# Altium schematic sheet MCU.SchDoc: Title
size A4; Date: *******; ApprovedBy: *******; CheckedBy: Yasiru; Author: *******; CompanyName: *******; DrawnBy: Name; Engineer: *******; Organization: *******; Address1: *******; Address2: *******; Address3: *******; Address4: *******; DocumentNumber: Doc Num; Revision: *******; SheetNumber: 9; SheetTotal: 11; Subtitle: MCU; Project: Resturant Robot; VersionRevision: III; TotalSheet: 11; CurrentTime: *******; CurrentDate: *******; Time: *******; DocumentFullPathAndName: *******; DocumentName: *******; ModifiedDate: *******; ImagePath: *******; ProjectName: *******; Application_BuildNumber: *******
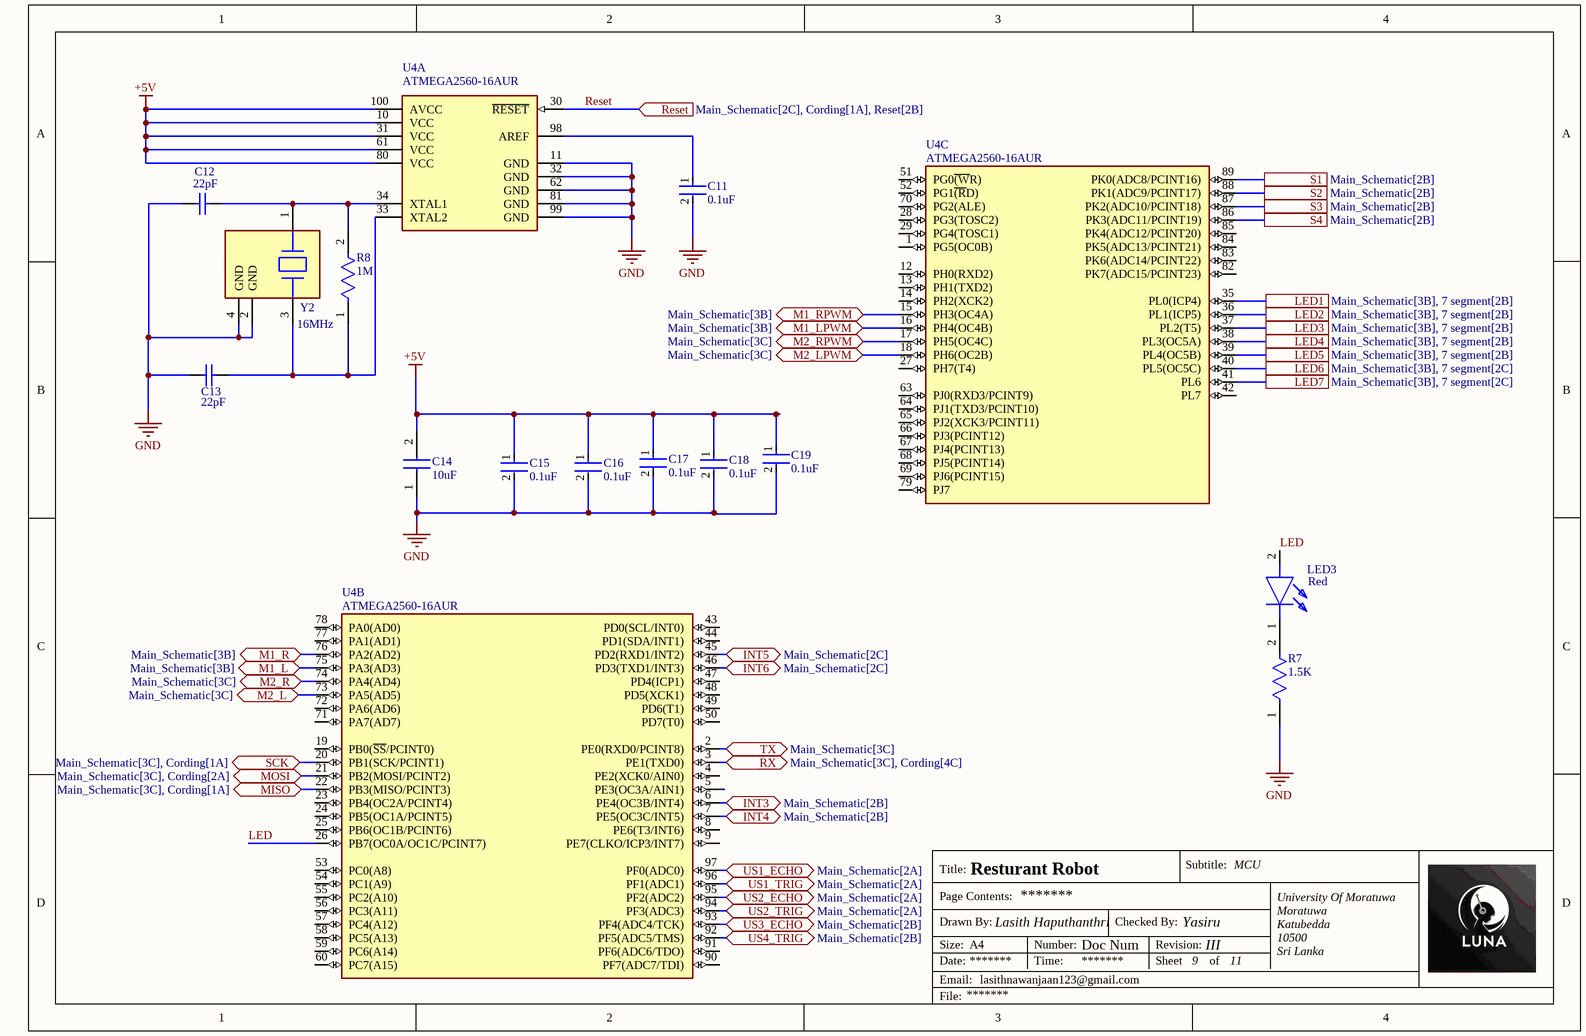
[diagram p0: MCU.SchDoc]

## Parts
C11  0.1uF  [FP-CC0603-DA-MFG]
C12  22pF  [CAPC1608X90X40LL10T20]
C13  22pF  [CAPC1608X90X40LL10T20]
C14  10uF  [CAPC1608X90N]
C15  0.1uF  [FP-CC0603-DA-MFG]
C16  0.1uF  [FP-CC0603-DA-MFG]
C17  0.1uF  [FP-CC0603-DA-MFG]
C18  0.1uF  [FP-CC0603-DA-MFG]
C19  0.1uF  [FP-CC0603-DA-MFG]
LED3  Red  [LEDC1608X55N]
R7  1.5K  [FP-AF0603-IPC_B]
R8  1M  [FP-AF0603-IPC_B]
U4  ATMEGA2560-16AUR  [FP-100A-MFG]  (parts A,B,C of 3)
Y2  16MHz  [FP-ABM8G-MFG]

## Ports
INT3 (bidir, see Main_Schematic[2B]), INT4 (bidir, see Main_Schematic[2B]), INT5 (bidir, see Main_Schematic[2C]), INT6 (bidir, see Main_Schematic[2C]), LED1 (see Main_Schematic[3B], 7 segment[2B]), LED2 (see Main_Schematic[3B], 7 segment[2B]), LED3 (see Main_Schematic[3B], 7 segment[2B]), LED4 (see Main_Schematic[3B], 7 segment[2B]), LED5 (see Main_Schematic[3B], 7 segment[2B]), LED6 (see Main_Schematic[3B], 7 segment[2C]), LED7 (see Main_Schematic[3B], 7 segment[2C]), M1_L (bidir, see Main_Schematic[3B]), M1_LPWM (bidir, see Main_Schematic[3B]), M1_R (bidir, see Main_Schematic[3B]), M1_RPWM (bidir, see Main_Schematic[3B]), M2_L (bidir, see Main_Schematic[3C]), M2_LPWM (bidir, see Main_Schematic[3C]), M2_R (bidir, see Main_Schematic[3C]), M2_RPWM (bidir, see Main_Schematic[3C]), MISO (bidir, see Main_Schematic[3C], Cording[1A]), MOSI (bidir, see Main_Schematic[3C], Cording[2A]), Reset (in, see Main_Schematic[2C], Cording[1A], Reset[2B]), RX (bidir, see Main_Schematic[3C], Cording[4C]), S1 (see Main_Schematic[2B]), S2 (see Main_Schematic[2B]), S3 (see Main_Schematic[2B]), S4 (see Main_Schematic[2B]), SCK (bidir, see Main_Schematic[3C], Cording[1A]), TX (bidir, see Main_Schematic[3C]), US1_ECHO (bidir, see Main_Schematic[2A]), US1_TRIG (bidir, see Main_Schematic[2A]), US2_ECHO (bidir, see Main_Schematic[2A]), US2_TRIG (bidir, see Main_Schematic[2A]), US3_ECHO (bidir, see Main_Schematic[2B]), US4_TRIG (bidir, see Main_Schematic[2B])

## Nets
+5V: C14.2 C15.1 C16.1 C17.1 C18.1 C19.1 U4.10(VCC) U4.31(VCC) U4.61(VCC) U4.80(VCC) U4.100(AVCC)
GND: C11.2 C12.1 C13.1 C14.1 C15.2 C16.2 C17.2 C18.2 C19.2 R7.1 U4.11(GND) U4.32(GND) U4.62(GND) U4.81(GND) U4.99(GND) Y2.2(GND) Y2.4(GND)
INT3: U4.6(PE4(OC3B/INT4)) ; port INT3
INT4: U4.7(PE5(OC3C/INT5)) ; port INT4
INT5: U4.45(PD2(RXD1/INT2)) ; port INT5
INT6: U4.46(PD3(TXD1/INT3)) ; port INT6
LED: LED3.2(A) U4.26(PB7(OC0A/OC1C/PCINT7))
LED1: U4.35(PL0(ICP4)) ; port LED1
LED2: U4.36(PL1(ICP5)) ; port LED2
LED3: U4.37(PL2(T5)) ; port LED3
LED4: U4.38(PL3(OC5A)) ; port LED4
LED5: U4.39(PL4(OC5B)) ; port LED5
LED6: U4.40(PL5(OC5C)) ; port LED6
LED7: U4.41(PL6) ; port LED7
M1_L: U4.75(PA3(AD3)) ; port M1_L
M1_LPWM: U4.16(PH4(OC4B)) ; port M1_LPWM
M1_R: U4.76(PA2(AD2)) ; port M1_R
M1_RPWM: U4.15(PH3(OC4A)) ; port M1_RPWM
M2_L: U4.73(PA5(AD5)) ; port M2_L
M2_LPWM: U4.18(PH6(OC2B)) ; port M2_LPWM
M2_R: U4.74(PA4(AD4)) ; port M2_R
M2_RPWM: U4.17(PH5(OC4C)) ; port M2_RPWM
MISO: U4.22(PB3(MISO/PCINT3)) ; port MISO
MOSI: U4.21(PB2(MOSI/PCINT2)) ; port MOSI
Reset: U4.30(~{RESET}) ; port Reset
RX: U4.3(PE1(TXD0)) ; port RX
S1: U4.89(PK0(ADC8/PCINT16)) ; port S1
S2: U4.88(PK1(ADC9/PCINT17)) ; port S2
S3: U4.87(PK2(ADC10/PCINT18)) ; port S3
S4: U4.86(PK3(ADC11/PCINT19)) ; port S4
SCK: U4.20(PB1(SCK/PCINT1)) ; port SCK
TX: U4.2(PE0(RXD0/PCINT8)) ; port TX
US1_ECHO: U4.97(PF0(ADC0)) ; port US1_ECHO
US1_TRIG: U4.96(PF1(ADC1)) ; port US1_TRIG
US2_ECHO: U4.95(PF2(ADC2)) ; port US2_ECHO
US2_TRIG: U4.94(PF3(ADC3)) ; port US2_TRIG
US3_ECHO: U4.93(PF4(ADC4/TCK)) ; port US3_ECHO
US4_TRIG: U4.92(PF5(ADC5/TMS)) ; port US4_TRIG
NetC11_1: C11.1 U4.98(AREF)
NetC12_2: C12.2 R8.2 U4.34(XTAL1) Y2.1
NetC13_2: C13.2 R8.1 U4.33(XTAL2) Y2.3
NetLED3_1: LED3.1(K) R7.2

Not connected (* = marked no-connect by the designer): U4 1(PG5(OC0B)) 4(PE2(XCK0/AIN0)) 5(PE3(OC3A/AIN1)) 8(PE6(T3/INT6)) 9(PE7(CLKO/ICP3/INT7)) 12(PH0(RXD2)) 13(PH1(TXD2)) 14(PH2(XCK2)) 19(PB0(~{SS}/PCINT0)) 23(PB4(OC2A/PCINT4)) 24(PB5(OC1A/PCINT5)) 25(PB6(OC1B/PCINT6)) 27(PH7(T4)) 28(PG3(TOSC2)) 29(PG4(TOSC1)) 42(PL7) 43(PD0(SCL/INT0)) 44(PD1(SDA/INT1)) 47(PD4(ICP1)) 48(PD5(XCK1)) 49(PD6(T1)) 50(PD7(T0)) 51(PG0~{(W}R)) 52(PG1~{(R}D)) 53(PC0(A8)) 54(PC1(A9)) 55(PC2(A10)) 56(PC3(A11)) 57(PC4(A12)) 58(PC5(A13)) 59(PC6(A14)) 60(PC7(A15)) 63(PJ0(RXD3/PCINT9)) 64(PJ1(TXD3/PCINT10)) 65(PJ2(XCK3/PCINT11)) 66(PJ3(PCINT12)) 67(PJ4(PCINT13)) 68(PJ5(PCINT14)) 69(PJ6(PCINT15)) 70(PG2(ALE)) 71(PA7(AD7)) 72(PA6(AD6)) 77(PA1(AD1)) 78(PA0(AD0)) 79(PJ7) 82(PK7(ADC15/PCINT23)) 83(PK6(ADC14/PCINT22)) 84(PK5(ADC13/PCINT21)) 85(PK4(ADC12/PCINT20)) 90(PF7(ADC7/TDI)) 91(PF6(ADC6/TDO))

## Notes on the sheet
- Title:
- Drawn By:
- Page Contents:
- Checked By:
- Subtitle:
- University Of Moratuwa
- Moratuwa
- Size:
- Date:
- File:
- Email:
- A4
- lasithnawanjaan123@gmail.com
- Lasith Haputhanthri
- Number:
- Time:
- Revision:
- Sheet
- of
- Katubedda
- 10500
- Sri Lanka

## Library data of the parts
C11 C15-C19 = CMP-2100-03601-2: CC0603KRX7R9BB104 CAP CER 0.1UF 50V X7R 0603; Manufacturer: YAGEO; Material: Ceramic; Capacitance: 100 nF; Temperature Coefficient: 15%; Tolerance: 0.1; Value: 100 nF; Height: 0.9mm; Voltage: 50 V; ComponentLink2Description: Datasheet; Device Class L2: Capacitors; Temperature Range High: +125°C; Category: Cap; Footprint Url: http://www.yageo.com/exep/pages/download/literatures/UPY-C_GEN_24.pdf; ComponentLink2URL: http://www.yageo.com/documents/recent/UPY-GPHC_X7R_6.3V-to-50V_18.pdf; Package: CC0603-DA; Temperature: -55°C to +125°C; Voltage Rating: 50 V; Temperature Characteristic: X7R; Device Class L1: Passive Components; Temperature Range Low: -55°C; Manufacturer Part Number: CC0603KRX7R9BB104; RoHS: TRUE; Automotive: No; Device Class L3: Ceramic Capacitors; Octopart: https://octopart.com/cc0603krx7r9bb104-yageo-42244635; Mouser Description: Multilayer Ceramic Capacitor, CC Series, 0.1 - F, - 10%, X7R, 50 V, 0603 [1608 Metric]; Lead Free: Yes; Digikey Description: CAP CER 0.1UF 50V X7R 0603
C12 C13 = CMP-1659-00026-1: CC0603JRNPO9BN220 Chip Capacitor, 22 pF, +/- 5%, 50 V, -55 to 125 degC, 0603 (1608 Metric), RoHS, Tape and Reel; ComponentLink1URL: http://www.yageo.com/; PackageReference: 0603; ComponentLink1Description: Manufacturer URL; PackageDescription: 2-Pin Surface Mount Device, Body 1.6 x 0.8 mm; DatasheetVersion: Rev. 8, 08/2011; ComponentLink2Description: Datasheet; ComponentLink2URL: http://www.yageo.com/documents/recent/UPY-GP_NP0_16V-to-50V_8.pdf
C14 = CL10A106KP8NNNC: CL10A106KP8NNNC Capacitor; Manufacturer_Name: SAMSUNG; Datasheet Link: https://datasheet.datasheetarchive.com/originals/distributors/Datasheets-DGA10/2415998.pdf; Height: 0.9mm; Manufacturer_Part_Number: CL10A106KP8NNNC; Mouser Part Number: 187-CL10A106KP8NNNC; Mouser Price/Stock: https://www.mouser.co.uk/ProductDetail/Samsung-Electro-Mechanics/CL10A106KP8NNNC?qs=X6jEic%2FHinAlyfRHj7fKwg%3D%3D; Arrow Part Number: CL10A106KP8NNNC; Arrow Price/Stock: https://www.arrow.com/en/products/cl10a106kp8nnnc/samsung-electro-mechanics?region=europe
LED3 = LTST-C191KRKT: LED; Manufacturer_Name: Lite-On; Datasheet Link: http://www.mouser.com/ds/2/239/S_110_LTST-C191KRKT-539838.pdf; Height: 0.55mm; Manufacturer_Part_Number: LTST-C191KRKT; Mouser Part Number: 859-LTST-C191KRKT; Mouser Price/Stock: https://www.mouser.co.uk/ProductDetail/Lite-On/LTST-C191KRKT?qs=BAIUz4Y8PJBLfOhzue0q%252BA%3D%3D; Arrow Part Number: LTST-C191KRKT; Arrow Price/Stock: https://www.arrow.com/en/products/ltst-c191krkt/lite-on-technology?region=nac
R7 R8 = CMP-03412-043191-1: AF0603FR-071K5L Anti-Sulfurated Chip Resistors Automotive Grade 1.5kΩ 1% 100ppm/°C 0603; Resistance: 1.5kR; Max Power Dissipation: 100mW; Length: 0.063inch; Packaging: Tape and Reel; Tolerance: 1%; RoHS Compliant: Yes; Series: AF; Temperature Coefficient: 100ppm/°C; Case/Package: 0603; Height: 0.022inch; Min Operating Temperature: -55°C; Resistor Type: Thick Film; Features: Moisture Resistant; Width: 0.031inch; Number of Terminations: 2; Max Operating Temperature: 155°C
U4 = CMP-06276-000073-1: IC MCU 8BIT 256KB FLASH 100TQFP; Oscillator Type: External; Interface: UART; Memory Type: OTP; Memory Size: 8KB; Core Architecture: PIC; Peripherals: POR; Frequency: 16MHz; Number of I/Os: 33; Packaging: Rail/Tube; Max Operating Temperature: 70°C; Case/Package: DIP; Min Operating Temperature: 0°C
Y2 = CMP-2000-05039-3: ABM8G-16.000MHZ-18-D2Y-T Crystal 16MHz ±20ppm (Tol) ±30ppm (Stability) 18pF FUND 120Ω 4-Pin SMD T/R; Series Resistance: 120R; Operating Frequency: 12 MHz; Frequency: 12MHz; Max Operating Temperature: 85°C; Mount: Surface Mount; Width: 2.5mm; Series: ABM8G; Termination: SMD/SMT; Frequency Tolerance: 20ppm; Tolerance: 20ppm; Min Operating Temperature: -40°C; Depth: 2.5mm; Load Capacitance: 18pF; Number of Pins: 4; Length: 3.2mm; Radiation Hardening: No; Frequency Stability: 30ppm; Height: 1mm; Packaging: Tape and Reel; Package Quantity: 1000; ESR (Equivalent Series Resistance): 120R; Lead Free: Lead Free; Case/Package: CSMD